# Altium project Safety_Lock.PrjPcb
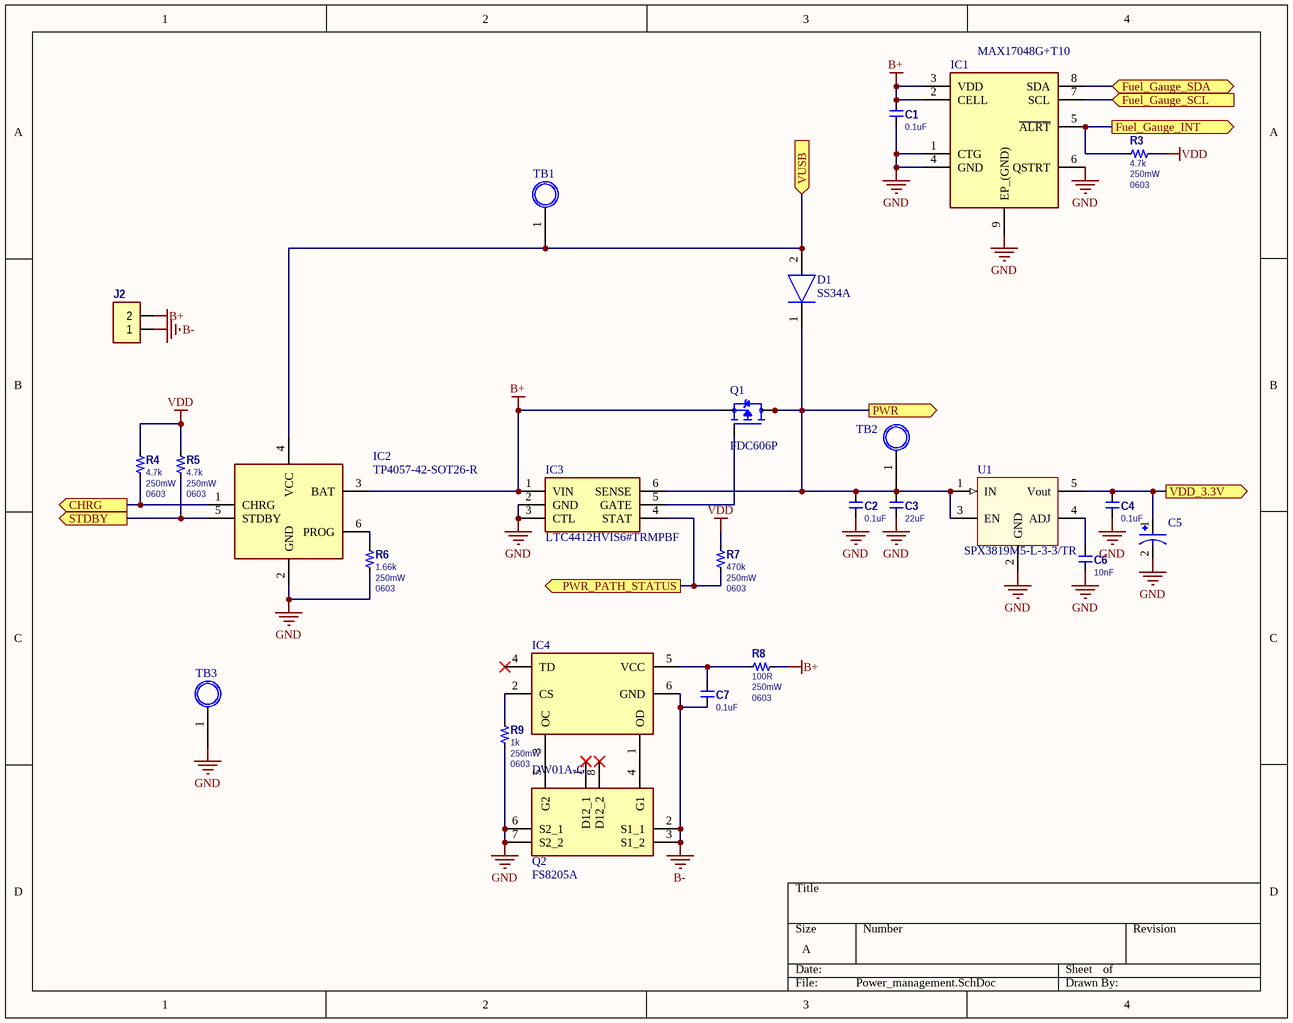
[diagram p0: Power_management.SchDoc]
3 sheets, 66 parts. Net scope: flat (ports and power ports of the same name join across sheets).
Board file: Safety_Lock.PcbDoc
Sheets:
  Power_management.SchDoc
  MCU.SchDoc
  Connectors.SchDoc

## Sheet Power_management.SchDoc
size A

### Parts
C1  0.1uF  [0603-C]
C2  0.1uF  [0603-C]
C3  22uF  [0603-C]
C4  0.1uF  [0603-C]
C5  T493X227K010BH6420_220uF  [CAPPM7343X430N]  (value not drawn)
C6  10nF  [0603-C]
C7  0.1uF  [0603-C]
D1  SS34A  [DIOM5026X262N]
IC1  MAX17048G+T10  [SON50P200X200X80-9N-D]
IC2  TP4057-42-SOT26-R  [SOT95P280X125-6N]
IC3  LTC4412HVIS6#TRMPBF  [SOT95P280X100-6N]
IC4  DW01A-G  [SOT95P280X135-6N]
J2  455-2247-ND  [CON_HDR1x2]  (value not drawn)
Q1  FDC606P  [SUPERSOT-6]
Q2  FS8205A  [SOP65P640X120-8N]
R3  4.7k  Power Rating: 250mW  Case/Package: 0603  [0603-R]
R4  4.7k  Power Rating: 250mW  Case/Package: 0603  [0603-R]
R5  4.7k  Power Rating: 250mW  Case/Package: 0603  [0603-R]
R6  1.66k  Power Rating: 250mW  Case/Package: 0603  [0603-R]
R7  470k  Power Rating: 250mW  Case/Package: 0603  [0603-R]
R8  100R  Power Rating: 250mW  Case/Package: 0603  [0603-R]
R9  1k  Power Rating: 250mW  Case/Package: 0603  [0603-R]
TB1  Test_Pad  [Test_Pad]  (value not drawn)
TB2  Test_Pad  [Test_Pad]  (value not drawn)
TB3  Test_Pad  [Test_Pad]  (value not drawn)
U1  SPX3819M5-L-3-3/TR  [SOT23-5]

### Ports
CHRG (out), Fuel_Gauge_INT (out), Fuel_Gauge_SCL (in), Fuel_Gauge_SDA (bidir), PWR (out), PWR_PATH_STATUS (out), STDBY (out), VDD_3.3V (out), VUSB (in)

### Nets
B+: C1.1 IC1.2(CELL) IC1.3(VDD) IC2.3(BAT) IC3.1(VIN) J2.2 Q1.4(S) R8.2
B-: C7.2 IC4.6(GND) J2.1 Q2.2(S1_1) Q2.3(S1_2)
GND: C1.2 C2.2 C3.2 C4.2 C5.2 C6.2 IC1.1(CTG) IC1.4(GND) IC1.6(QSTRT) IC1.9(EP_(GND)) IC2.2(GND) IC3.2(GND) IC3.3(CTL) Q2.6(S2_1) Q2.7(S2_2) R6.2 R9.2 TB3.1 U1.2(GND)
VDD: R3.2 R4.1 R5.1 R7.2
NetC2_1: C2.1 C3.1 D1.1(K) IC3.6(SENSE) Q1.1(D) Q1.2(D) Q1.5(D) Q1.6(D) TB2.1 U1.1(IN) U1.3(EN) ; port PWR
NetC4_1: C4.1 C5.1 U1.5(Vout) ; port VDD_3.3V
NetC6_1: C6.1 U1.4(ADJ)
NetC7_1: C7.1 IC4.5(VCC) R8.1
NetD1_2: D1.2(A) IC2.4(VCC) TB1.1 ; port VUSB
NetIC1_5: IC1.5(~{ALRT}) R3.1 ; port Fuel_Gauge_INT
NetIC1_7: IC1.7(SCL) ; port Fuel_Gauge_SCL
NetIC1_8: IC1.8(SDA) ; port Fuel_Gauge_SDA
NetIC2_1: IC2.1(CHRG) R4.2 ; port CHRG
NetIC2_5: IC2.5(STDBY) R5.2 ; port STDBY
NetIC2_6: IC2.6(PROG) R6.1
NetIC3_4: IC3.4(STAT) R7.1 ; port PWR_PATH_STATUS
NetIC3_5: IC3.5(GATE) Q1.3(G)
NetIC4_1: IC4.1(OD) Q2.4(G1)
NetIC4_2: IC4.2(CS) R9.1
NetIC4_3: IC4.3(OC) Q2.5(G2)

Not connected (* = marked no-connect by the designer): IC4 4(TD)*; Q2 1(D12_1)* 8(D12_2)*

### Library data of the parts
C1-C4 C6 C7 = CAP: Manufacturer: TDK EPCOS; Manufacturer Part Number: B37941K9105K62; Capacitance: 1uF; Voltage Rating: 16V; Tolerance: 10%; ComponentLink1URL: https://datasheet.ciiva.com/13389/upy-gphc-y5v-6-3v-to-50v-5-13389978.pdf?src-supplier=Mouser; ComponentLink1Description: Datasheet; Supplier 1: Digi-Key; RoHS: Yes; Category: Ceramic Capacitors; Mount: Surface Mount; Case/Package: 0805; Case Code (Metric): 2012; Case Code (Imperial): 0805; Min Operating Temperature: -55°C; Max Operating Temperature: 125°C; Package Quantity: 3000; Packaging: Tape and Reel; Voltage Rating (DC): 16V; Length: 0.079inch; Width: 0.049inch; Height: 1.35mm; Thickness: 0.049inch; Ratings: AEC-Q200; Lead Free: Lead Free; ComponentLink2URL: http://components.arrow.com/part/dataview/0323_01879911?src-supplier=Arrow+Europe; ComponentLink2Description: http://components.arrow.com/part/dataview/0323_01879911?src-supplier=Arrow+Europe; ComponentLink3URL: https://media.digikey.com/pdf/Data%20Sheets/Epcos%20PDFs/B37872K_B37941K_Series.pdf?src-supplier=Digi-Key; ComponentLink3Description: https://media.digikey.com/pdf/Data%20Sheets/Epcos%20PDFs/B37872K_B37941K_Series.pdf?src-supplier=Digi-Key; Supplier Part Number 1: 495-1935-1-ND
C5 = T493X227K010BH6420_220uF: MF: Kemet; Value: *; MP: T493X227K010BH6420; Package: SMD-2 Kemet; Availability: In Stock; Check_prices: https://www.snapeda.com/parts/T493X227K010BH6420/Kemet/view-part/?ref=eda; SnapEDA_Link: https://www.snapeda.com/parts/T493X227K010BH6420/Kemet/view-part/?ref=snap; Price: None
D1 = SS34A: Diode; Manufacturer_Name: HY Electronic Corp; Datasheet Link: https://datasheet.datasheetarchive.com/originals/distributors/Datasheets-3/DSA-43252.pdf; Height: 2.62mm; Manufacturer_Part_Number: SS34A
IC1 = MAX17048G+T10: Integrated Circuit; Manufacturer_Name: Maxim Integrated; Datasheet Link: https://datasheets.maximintegrated.com/en/ds/MAX17048-MAX17049.pdf; Height: 0.8mm; Manufacturer_Part_Number: MAX17048G+T10; Mouser Part Number: 700-MAX17048G+T10; Mouser Price/Stock: https://www.mouser.co.uk/ProductDetail/Maxim-Integrated/MAX17048G%2bT10?qs=D7PJwyCwLAoGnnn8jEPRBQ%3D%3D; Arrow Part Number: MAX17048G+T10; Arrow Price/Stock: https://www.arrow.com/en/products/max17048gt10/maxim-integrated?region=nac
IC2 = TP4057-42-SOT26-R: Integrated Circuit; Manufacturer_Name: Nanjing Extension Microelectronics; Datasheet Link: https://datasheet.lcsc.com/szlcsc/Nanjing-Extension-Microelectronics-TP4057_C12044.pdf; Height: 1.25mm; Manufacturer_Part_Number: TP4057-42-SOT26-R
IC3 = LTC4412HVIS6#TRMPBF: Integrated Circuit; Manufacturer_Name: Linear Technology; Datasheet Link: https://datasheet.datasheetarchive.com/originals/dk/DKDS-14/267243.pdf; Height: 1mm; Manufacturer_Part_Number: LTC4412HVIS6#TRMPBF; Mouser Part Number: 584-C4412HVIS6TRMPBF; Mouser Price/Stock: https://www.mouser.co.uk/ProductDetail/Analog-Devices-Linear-Technology/LTC4412HVIS6TRMPBF?qs=hVkxg5c3xu%2F0qD9zc%2Fd4vw%3D%3D; Arrow Part Number: LTC4412HVIS6#TRMPBF; Arrow Price/Stock: https://www.arrow.com/en/products/ltc4412hvis6trmpbf/linear-technology
IC4 = DW01A-G: Integrated Circuit; Manufacturer_Name: Fortune Semiconductor Corporation; Datasheet Link: http://acoptex.com/uploads/DW01A.pdf; Height: 1.35mm; Manufacturer_Part_Number: DW01A-G
J2 = CON_HDR1x2: ComponentLink1URL: https://www.jst-mfg.com/product/pdf/eng/eXH.pdf; ComponentLink1Description: Datasheet
Q1 = FDC606P: P-Channel 12V 6A (Ta) 1.6W (Ta) Surface Mount SuperSOTâ„¢-6; MF: ON Semiconductor; Price: None; Purchase-URL: https://pricing.snapeda.com/search/part/FDC606P/?ref=eda; Value: *; Availability: Good; Check_prices: https://www.snapeda.com/parts/FDC606P/ON%20Semiconductor/view-part/2501971/?ref=eda; SnapEDA_Link: https://www.snapeda.com/parts/FDC606P/ON%20Semiconductor/view-part/2501971/?ref=snap; MP: FDC606P; Package: TSOT-23-6 ON Semiconductor
Q2 = FS8205A: Transistor; Manufacturer_Name: SII Semiconductor; Datasheet Link: http://www.ic-fortune.com/upload/Download/FS8205A-DS-12_EN.pdf; Height: 1.2mm; Manufacturer_Part_Number: FS8205A
R3-R9 = Res: Manufacturer: Panasonic; Manufacturer Part Number: ERJ-8GEYJ621V; Resistance: 620R; Tolerance: 5%; Voltage Rating: 200V; Temperature Coefficient: 200ppm/°C; ComponentLink1URL: https://datasheet.ciiva.com/15193/getdatasheetpartid-366470-15193725.pdf?src-supplier=Verical; ComponentLink1Description: Datasheet; Supplier 1: Avnet; Stock 1: 6255; Pricing 1: 1 = 0.01200 (USD); RoHS: Yes; Mount: Surface Mount; Case Code (Metric): 3216; Case Code (Imperial): 1206; Contact Plating: Tin; Min Operating Temperature: -55°C; Max Operating Temperature: 155°C; Packaging: Tape and Reel; Package Quantity: 1; Resistor Type: Thick Film; Number of Terminations: 2; Max Power Dissipation: 250mW; Voltage Rating (DC): 200V; Features: Automotive AEC-Q200; Series: ERJ; Construction: Rectangular; Resistance Tolerance: 5%; Length: 3.2mm; Width: 0.063inch; Height: 0.028inch; Depth: 1.6mm; Radiation Hardening: No; REACH SVHC: No SVHC; Military Standard: Not; Lead Free: Lead Free; RoHS Compliant: Yes; ComponentLink2URL: https://datasheet.ciiva.com/46387/1500035-46387094.pdf?src-supplier=Element14; ComponentLink2Description: https://datasheet.ciiva.com/46387/1500035-46387094.pdf?src-supplier=Element14; ComponentLink3URL: https://datasheet.ciiva.com/5915/1500035-5915369.pdf?src-supplier=Farnell; ComponentLink3Description: https://datasheet.ciiva.com/5915/1500035-5915369.pdf?src-supplier=Farnell; ComponentLink4URL: https://datasheet.ciiva.com/28677/1678796-28677018.pdf?src-supplier=Element14; ComponentLink4Description: https://datasheet.ciiva.com/28677/1678796-28677018.pdf?src-supplier=Element14; ComponentLink5URL: https://datasheet.ciiva.com/17204/aoa0000ce1-17204972.pdf?src-supplier=Avnet+Europe; ComponentLink5Description: https://datasheet.ciiva.com/17204/aoa0000ce1-17204972.pdf?src-supplier=Avnet+Europe; ComponentLink6URL: https://datasheet.ciiva.com/16515/aoa0000ce1-16515933.pdf?src-supplier=Avnet+Asia; ComponentLink6Description: https://datasheet.ciiva.com/16515/aoa0000ce1-16515933.pdf?src-supplier=Avnet+Asia; Supplier Part Number 1: 65T8955
U1 = SPX3819: Linear Voltage Regulator IC 1 Output 500mA SOT-23-5; MF: MaxLinear, Inc.; SnapEDA_Link: https://www.snapeda.com/parts/SPX3819/MaxLinear,%20Inc./view-part/885098/?ref=snap; Package: SOT-23-5 MaxLinear, Inc.; Availability: Unavailable; Price: None; MP: SPX3819; Value: *

## Sheet MCU.SchDoc: MCU
size A4; DocumentNumber: MB1136; Revision: C.3; SheetNumber: 2; SheetTotal: 4; Project: NUCLEO-XXXXRX
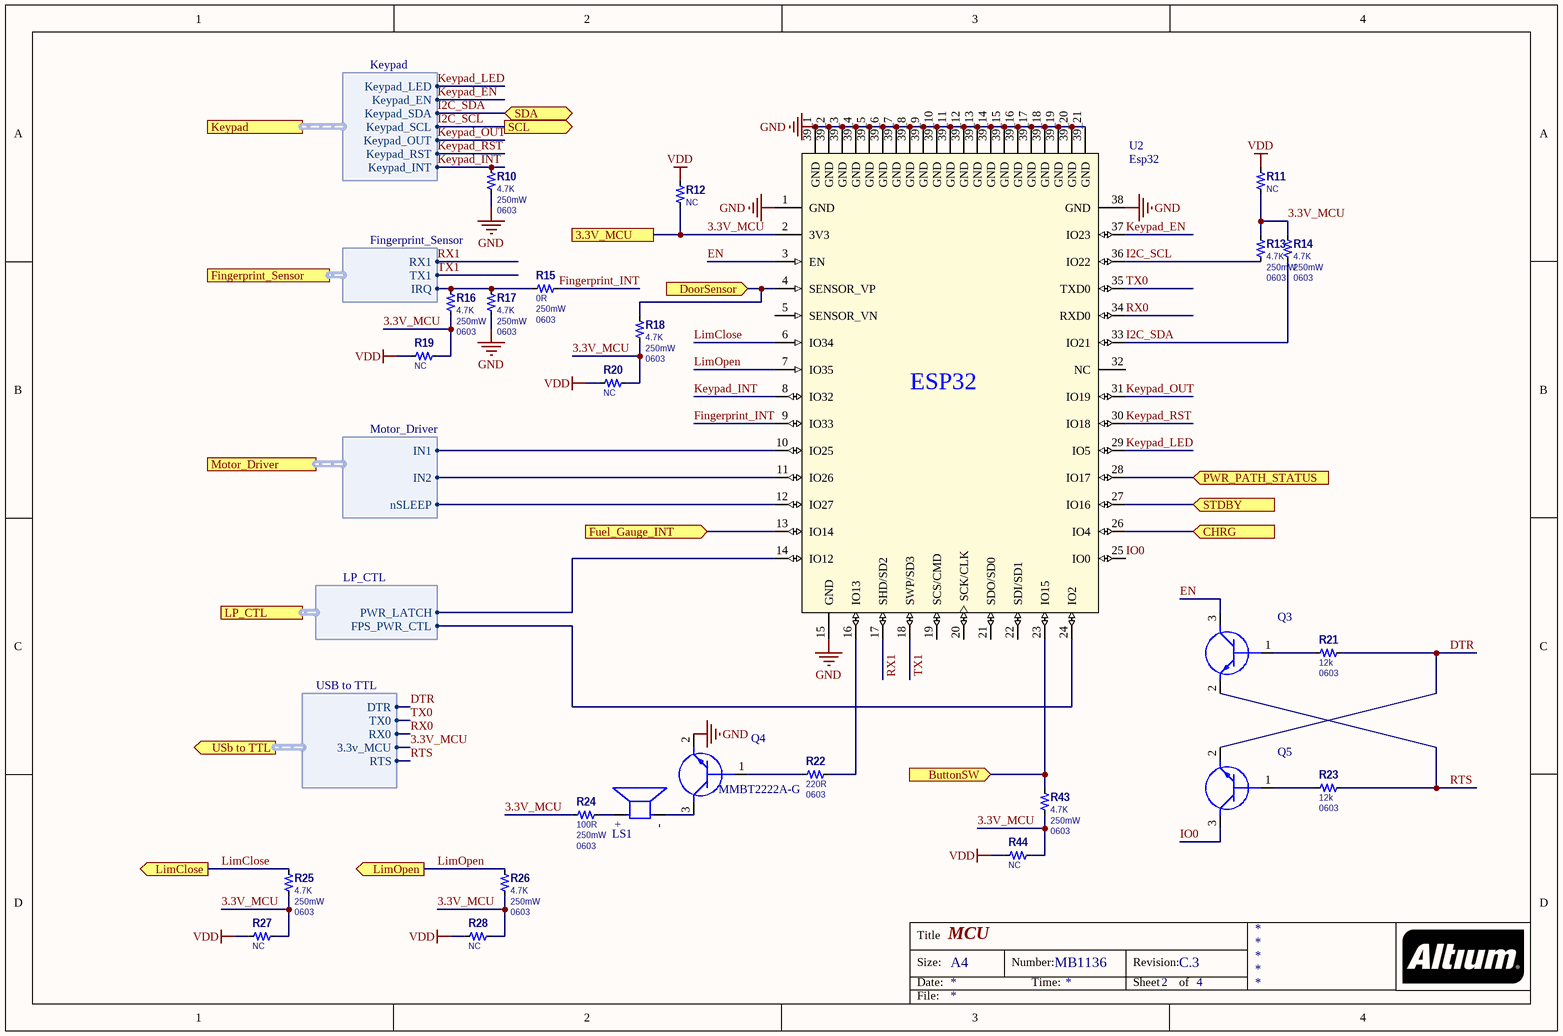
[diagram p1: MCU.SchDoc]

### Parts
LS1  AI-1223-TWT-3V-2-R  [XDCR_AI-1223-TWT-3V-2-R]  (value not drawn)
Q3  MMBT2222A-G  [SOT95P240X115-3N]  (value not drawn)
Q4  MMBT2222A-G  [SOT95P240X115-3N]
Q5  MMBT2222A-G  [SOT95P240X115-3N]  (value not drawn)
R10  4.7K  Power Rating: 250mW  Case/Package: 0603  [0603-R]
R11  NC  [0603-R]
R12  NC  [0603-R]
R13  4.7K  Power Rating: 250mW  Case/Package: 0603  [0603-R]
R14  4.7K  Power Rating: 250mW  Case/Package: 0603  [0603-R]
R15  0R  Power Rating: 250mW  Case/Package: 0603  [0603-R]
R16  4.7K  Power Rating: 250mW  Case/Package: 0603  [0603-R]
R17  4.7K  Power Rating: 250mW  Case/Package: 0603  [0603-R]
R18  4.7K  Power Rating: 250mW  Case/Package: 0603  [0603-R]
R19  NC  [0603-R]
R20  NC  [0603-R]
R21  12k  Case/Package: 0603  [0603-R]
R22  220R  Case/Package: 0603  [0603-R]
R23  12k  Case/Package: 0603  [0603-R]
R24  100R  Power Rating: 250mW  Case/Package: 0603  [0603-R]
R25  4.7K  Power Rating: 250mW  Case/Package: 0603  [0603-R]
R26  4.7K  Power Rating: 250mW  Case/Package: 0603  [0603-R]
R27  NC  [0603-R]
R28  NC  [0603-R]
R43  4.7K  Power Rating: 250mW  Case/Package: 0603  [0603-R]
R44  NC  [0603-R]
U2  Esp32  [MODULE_ESP32-WROOM-32]

### Ports
3.3V_MCU, ButtonSW (in), CHRG (in), DoorSensor (in), Fingerprint_Sensor (harness Fingerprint_Sensor), Fuel_Gauge_INT (in), Keypad (harness Keypad), LimClose (out), LimOpen (out), LP_CTL (harness LP_CTL), Motor_Driver (harness Motor_Driver), PWR_PATH_STATUS (in), SCL (out), SDA (bidir), STDBY (in), USb to TTL (out, harness USB to TTL)

### Harnesses
Keypad: Keypad_RST, Keypad_EN, Keypad_SDA, Keypad_SCL, Keypad_OUT, Keypad_INT, Keypad_LED
Fingerprint_Sensor: RX1, TX1, IRQ
Motor_Driver: IN1, IN2, nSLEEP
LP_CTL: PWR_LATCH, FPS_PWR_CTL
USB to TTL: TX0, RX0, DTR, RTS, 3.3v_MCU

### Nets
GND: Q4.2(E) R10.2 R17.2 U2.1(GND) U2.15(GND) U2.38(GND) U2.39_1(GND) U2.39_2(GND) U2.39_3(GND) U2.39_4(GND) U2.39_5(GND) U2.39_6(GND) U2.39_7(GND) U2.39_8(GND) U2.39_9(GND) U2.39_10(GND) U2.39_11(GND) U2.39_12(GND) U2.39_13(GND) U2.39_14(GND) U2.39_15(GND) U2.39_16(GND) U2.39_17(GND) U2.39_18(GND) U2.39_19(GND) U2.39_20(GND) U2.39_21(GND)
VDD: R11.2 R12.2 R19.1 R20.1 R27.1 R28.1 R44.1
3.3V_MCU: R11.1 R12.1 R13.1 R14.1 R16.2 R18.2 R19.2 R20.2 R24.1 R25.2 R26.2 R27.2 R28.2 R43.2 R44.2 U2.2(3V3) ; port 3.3V_MCU, port USb to TTL.3.3v_MCU
DTR: Q5.2(E) R21.1 ; port USb to TTL.DTR
EN: Q3.3(C) U2.3(EN)
Fingerprint_INT: R15.2 U2.9(IO33)
I2C_SCL: R13.2 U2.36(IO22) ; port SCL, port Keypad.Keypad_SCL
I2C_SDA: R14.2 U2.33(IO21) ; port SDA, port Keypad.Keypad_SDA
IO0: Q5.3(C) U2.25(IO0)
Keypad_EN: U2.37(IO23) ; port Keypad.Keypad_EN
Keypad_INT: R10.1 U2.8(IO32) ; port Keypad.Keypad_INT
Keypad_LED: U2.29(IO5) ; port Keypad.Keypad_LED
Keypad_OUT: U2.31(IO19) ; port Keypad.Keypad_OUT
Keypad_RST: U2.30(IO18) ; port Keypad.Keypad_RST
LimClose: R25.1 U2.6(IO34) ; port LimClose
LimOpen: R26.1 U2.7(IO35) ; port LimOpen
RTS: Q3.2(E) R23.1 ; port USb to TTL.RTS
RX0: U2.34(RXD0) ; port USb to TTL.RX0
RX1: U2.17(SHD/SD2) ; port Fingerprint_Sensor.RX1
TX0: U2.35(TXD0) ; port USb to TTL.TX0
TX1: U2.18(SWP/SD3) ; port Fingerprint_Sensor.TX1
NetIC1_5: U2.13(IO14) ; port Fuel_Gauge_INT
NetIC2_1: U2.26(IO4) ; port CHRG
NetIC2_5: U2.27(IO16) ; port STDBY
NetIC3_4: U2.28(IO17) ; port PWR_PATH_STATUS
NetJ5_5: R15.1 R16.1 R17.1 ; port Fingerprint_Sensor.IRQ
NetJ10_1: R18.1 U2.4(SENSOR_VP) ; port DoorSensor
NetJ11_1: R43.1 U2.23(IO15) ; port ButtonSW
NetLS1_N: LS1.N Q4.3(C)
NetLS1_P: LS1.P R24.2
NetQ3_1: Q3.1(B) R21.2
NetQ4_1: Q4.1(B) R22.2
NetQ5_1: Q5.1(B) R23.2
NetR22_1: R22.1 U2.16(IO13)
NetU2_10: U2.10(IO25) ; port Motor_Driver.IN1
NetU2_11: U2.11(IO26) ; port Motor_Driver.IN2
NetU2_12: U2.12(IO27) ; port Motor_Driver.nSLEEP
NetU2_14: U2.14(IO12) ; port LP_CTL.PWR_LATCH
NetU2_24: U2.24(IO2) ; port LP_CTL.FPS_PWR_CTL

Not connected (* = marked no-connect by the designer): U2 5(SENSOR_VN) 19(SCS/CMD) 20(SCK/CLK) 21(SDO/SD0) 22(SDI/SD1) 32(NC)

### Notes on the sheet
- Title
- Size:
- Date:
- A4
- Number:
- Time:
- Revision:
- Sheet
- of
- File:
- (in symbol AI-1223-TWT-3V-2-R) +; -
- (in symbol ESP32-WROOM-32) ESP32

### Library data of the parts
LS1 = AI-1223-TWT-3V-2-R: AUDIO INDICATOR 82 DB 3 VDC 2300 HZ; MF: PUI Audio,; SnapEDA_Link: https://www.snapeda.com/parts/AI-1223-TWT-3V-2-R/PUI%20Audio,%20Inc./view-part/548758/?ref=snap; Availability: In Stock; Price: None; Purchase-URL: https://pricing.snapeda.com/search/part/AI-1223-TWT-3V-2-R/?ref=eda; Check_prices: https://www.snapeda.com/parts/AI-1223-TWT-3V-2-R/PUI%20Audio,%20Inc./view-part/548758/?ref=eda; Package: None; MP: AI-1223-TWT-3V-2-R; Value: *
Q3 = MMBT2222A-G_Mirror: Transistor BJT NPN; Manufacturer_Name: Comchip Technology; Datasheet Link: http://www.comchiptech.com/admin/files/product/MMBT2222A-G%20RevB.pdf; Height: 1.15mm; Manufacturer_Part_Number: MMBT2222A-G; Mouser Part Number: 750-MMBT2222A-G; Mouser Price/Stock: https://www.mouser.co.uk/ProductDetail/Comchip-Technology/MMBT2222A-G?qs=2qJf6qQ4IOIM%2FSE9iCL8gQ%3D%3D; Arrow Part Number: MMBT2222A-G; Arrow Price/Stock: https://www.arrow.com/en/products/mmbt2222a-g/comchip-technology
Q4 Q5 = MMBT2222A-G: Transistor BJT NPN; Manufacturer_Name: Comchip Technology; Datasheet Link: http://www.comchiptech.com/admin/files/product/MMBT2222A-G%20RevB.pdf; Height: 1.15mm; Manufacturer_Part_Number: MMBT2222A-G; Mouser Part Number: 750-MMBT2222A-G; Mouser Price/Stock: https://www.mouser.co.uk/ProductDetail/Comchip-Technology/MMBT2222A-G?qs=2qJf6qQ4IOIM%2FSE9iCL8gQ%3D%3D; Arrow Part Number: MMBT2222A-G; Arrow Price/Stock: https://www.arrow.com/en/products/mmbt2222a-g/comchip-technology
R10 R13-R18 R24-R26 R43 = Res: as R3 on sheet Power_management; ComponentLink1URL: https://datasheet.ciiva.com/15193/getdatasheetpartid-366470-15193725.pdf?src-supplier=Verical; ComponentLink1Description: Datasheet; Supplier 1: Avnet; Stock 1: 6255; Pricing 1: 1 = 0.01200 (USD); RoHS: Yes; Mount: Surface Mount; Case Code (Metric): 3216; Case Code (Imperial): 1206; Contact Plating: Tin; Min Operating Temperature: -55°C; Max Operating Temperature: 155°C; Packaging: Tape and Reel; Package Quantity: 1; Resistor Type: Thick Film; Number of Terminations: 2; Max Power Dissipation: 250mW; Voltage Rating (DC): 200V; Features: Automotive AEC-Q200; Series: ERJ; Construction: Rectangular; Resistance Tolerance: 5%; Length: 3.2mm; Width: 0.063inch; Height: 0.028inch; Depth: 1.6mm; Radiation Hardening: No; REACH SVHC: No SVHC; Military Standard: Not; Lead Free: Lead Free; RoHS Compliant: Yes; ComponentLink2URL: https://datasheet.ciiva.com/46387/1500035-46387094.pdf?src-supplier=Element14; ComponentLink2Description: https://datasheet.ciiva.com/46387/1500035-46387094.pdf?src-supplier=Element14; ComponentLink3URL: https://datasheet.ciiva.com/5915/1500035-5915369.pdf?src-supplier=Farnell; ComponentLink3Description: https://datasheet.ciiva.com/5915/1500035-5915369.pdf?src-supplier=Farnell; ComponentLink4URL: https://datasheet.ciiva.com/28677/1678796-28677018.pdf?src-supplier=Element14; ComponentLink4Description: https://datasheet.ciiva.com/28677/1678796-28677018.pdf?src-supplier=Element14; ComponentLink5URL: https://datasheet.ciiva.com/17204/aoa0000ce1-17204972.pdf?src-supplier=Avnet+Europe; ComponentLink5Description: https://datasheet.ciiva.com/17204/aoa0000ce1-17204972.pdf?src-supplier=Avnet+Europe; ComponentLink6URL: https://datasheet.ciiva.com/16515/aoa0000ce1-16515933.pdf?src-supplier=Avnet+Asia; ComponentLink6Description: https://datasheet.ciiva.com/16515/aoa0000ce1-16515933.pdf?src-supplier=Avnet+Asia; Supplier Part Number 1: 65T8955
R11 R12 R19-R23 R27 R28 R44 = Res: Manufacturer: Panasonic; Manufacturer Part Number: ERJ-8GEYJ621V; Resistance: 620R; Tolerance: 5%; Voltage Rating: 200V; Temperature Coefficient: 200ppm/°C; Max Power Dissipation: 250mW; ComponentLink1URL: https://datasheet.ciiva.com/15193/getdatasheetpartid-366470-15193725.pdf?src-supplier=Verical; ComponentLink1Description: Datasheet; Supplier 1: Avnet; Stock 1: 6255; Pricing 1: 1 = 0.01200 (USD); RoHS: Yes; Mount: Surface Mount; Case Code (Metric): 3216; Case Code (Imperial): 1206; Contact Plating: Tin; Min Operating Temperature: -55°C; Max Operating Temperature: 155°C; Packaging: Tape and Reel; Package Quantity: 1; Resistor Type: Thick Film; Number of Terminations: 2; Voltage Rating (DC): 200V; Features: Automotive AEC-Q200; Series: ERJ; Construction: Rectangular; Resistance Tolerance: 5%; Length: 3.2mm; Width: 0.063inch; Height: 0.028inch; Depth: 1.6mm; Radiation Hardening: No; REACH SVHC: No SVHC; Military Standard: Not; Lead Free: Lead Free; RoHS Compliant: Yes; ComponentLink2URL: https://datasheet.ciiva.com/46387/1500035-46387094.pdf?src-supplier=Element14; ComponentLink2Description: https://datasheet.ciiva.com/46387/1500035-46387094.pdf?src-supplier=Element14; ComponentLink3URL: https://datasheet.ciiva.com/5915/1500035-5915369.pdf?src-supplier=Farnell; ComponentLink3Description: https://datasheet.ciiva.com/5915/1500035-5915369.pdf?src-supplier=Farnell; ComponentLink4URL: https://datasheet.ciiva.com/28677/1678796-28677018.pdf?src-supplier=Element14; ComponentLink4Description: https://datasheet.ciiva.com/28677/1678796-28677018.pdf?src-supplier=Element14; ComponentLink5URL: https://datasheet.ciiva.com/17204/aoa0000ce1-17204972.pdf?src-supplier=Avnet+Europe; ComponentLink5Description: https://datasheet.ciiva.com/17204/aoa0000ce1-17204972.pdf?src-supplier=Avnet+Europe; ComponentLink6URL: https://datasheet.ciiva.com/16515/aoa0000ce1-16515933.pdf?src-supplier=Avnet+Asia; ComponentLink6Description: https://datasheet.ciiva.com/16515/aoa0000ce1-16515933.pdf?src-supplier=Avnet+Asia; Supplier Part Number 1: 65T8955; Power Rating: 250mW
  R11 R12 R19 R20 R27 R28 R44: Case/Package: 0603
U2 = ESP32-WROOM-32: Bluetooth, WiFi Transceiver Module 2.4GHz ~ 2.5GHz Surface Mount; MF: Espressif Systems; Package: Module Espressif Systems; Digi-Key_Part_Number: 1904-1010-1-ND; Digi-Key_Purchase_URL: https://www.digikey.com/product-detail/en/espressif-systems/ESP32-WROOM-32/1904-1010-1-ND/8544305?utm_source=snapeda&utm_medium=aggregator&utm_campaign=symbol; Value: *; MP: ESP32-WROOM-32; SnapEDA_Link: https://www.snapeda.com/parts/ESP32-WROOM-32/Espressif%20Systems/view-part/2753322/?ref=snap

## Sheet Connectors.SchDoc
size A3
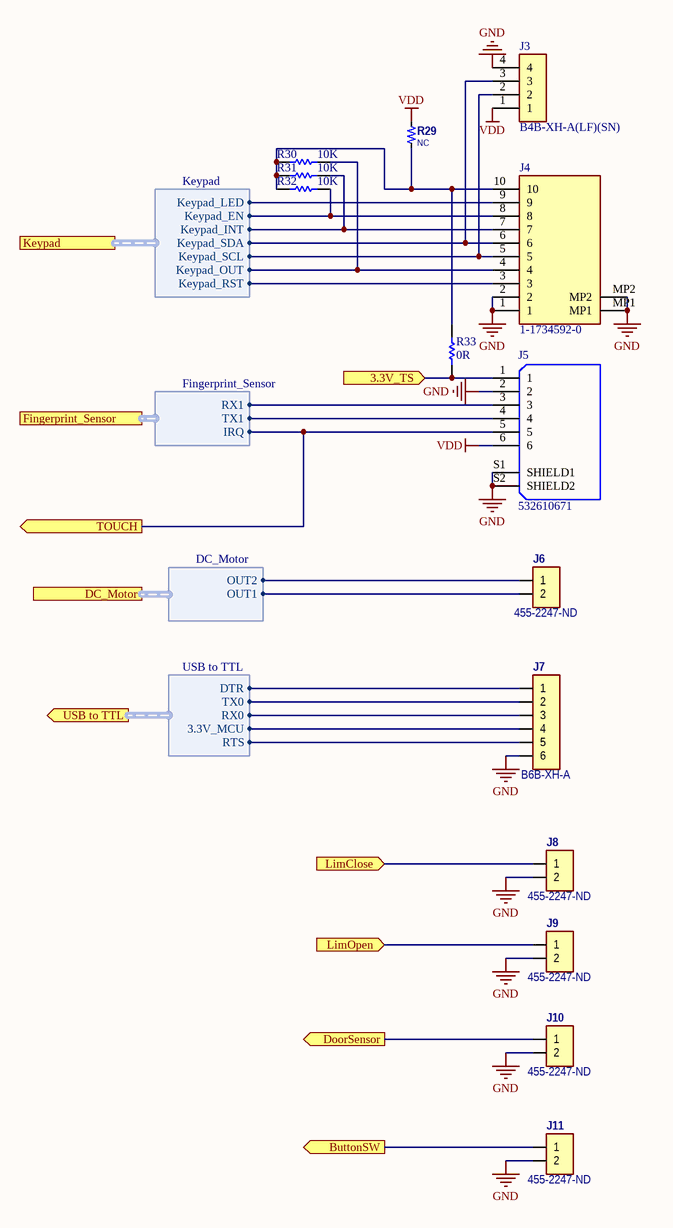
[diagram p2: Connectors.SchDoc]

### Parts
J3  B4B-XH-A(LF)(SN)  [JST_B4B-XH-A(LF)(SN)]
J4  1-1734592-0  [117345920]
J5  532610671  [MOLEX_532610671]
J6  455-2247-ND  [CON_HDR1x2]
J7  B6B-XH-A  [CON_HDR1x6_2p50_SHRD_JST-B6B-XH-A]
J8  455-2247-ND  [CON_HDR1x2]
J9  455-2247-ND  [CON_HDR1x2]
J10  455-2247-ND  [CON_HDR1x2]
J11  455-2247-ND  [CON_HDR1x2]
R29  NC  [0603-R]
R30  10K  [0603R]
R31  10K  [0603R]
R32  10K  [0603R]
R33  0R  [0603R]

### Ports
3.3V_TS (in), ButtonSW (out), DC_Motor (harness DC_Motor), DoorSensor (out), Fingerprint_Sensor (harness Fingerprint_Sensor), Keypad (harness Keypad), LimClose (in), LimOpen (in), TOUCH (out), USB to TTL (out, harness USB to TTL)

### Harnesses
Keypad: Keypad_RST, Keypad_EN, Keypad_SDA, Keypad_SCL, Keypad_OUT, Keypad_INT, Keypad_LED
Fingerprint_Sensor: RX1, TX1, IRQ
DC_Motor: OUT1, OUT2
USB to TTL: TX0, RX0, DTR, RTS, 3.3V_MCU

### Nets
GND: J3.4 J4.1 J4.2 J4.MP1 J4.MP2 J5.2 J5.S1(SHIELD1) J5.S2(SHIELD2) J7.6 J8.2 J9.2 J10.2 J11.2
VDD: J3.1 J5.6 R29.2
3.3V_MCU: J7.4 ; port USB to TTL.3.3V_MCU
DTR: J7.1 ; port USB to TTL.DTR
I2C_SCL: J3.2 J4.5 ; port Keypad.Keypad_SCL
I2C_SDA: J3.3 J4.6 ; port Keypad.Keypad_SDA
Keypad_EN: J4.8 R32.2 ; port Keypad.Keypad_EN
Keypad_INT: J4.7 R31.2 ; port Keypad.Keypad_INT
Keypad_LED: J4.9 ; port Keypad.Keypad_LED
Keypad_OUT: J4.4 R30.2 ; port Keypad.Keypad_OUT
Keypad_RST: J4.3 ; port Keypad.Keypad_RST
LimClose: J8.1 ; port LimClose
LimOpen: J9.1 ; port LimOpen
RTS: J7.5 ; port USB to TTL.RTS
RX0: J7.3 ; port USB to TTL.RX0
RX1: J5.3 ; port Fingerprint_Sensor.RX1
TX0: J7.2 ; port USB to TTL.TX0
TX1: J5.4 ; port Fingerprint_Sensor.TX1
NetJ4_10: J4.10 R29.1 R30.1 R31.1 R32.1 R33.2
NetJ5_1: J5.1 R33.1 ; port 3.3V_TS
NetJ5_5: J5.5 ; port TOUCH, port Fingerprint_Sensor.IRQ
NetJ6_1: J6.1 ; port DC_Motor.OUT2
NetJ6_2: J6.2 ; port DC_Motor.OUT1
NetJ10_1: J10.1 ; port DoorSensor
NetJ11_1: J11.1 ; port ButtonSW

### Library data of the parts
J3 = B4B-XH-A(LF)(SN): Connector Header Through Hole 4 position 0.098 (2.50mm); MF: JST Sales; Check_prices: https://www.snapeda.com/parts/B4B-XH-A(LF)(SN)/JST%20Sales%20America%20Inc./view-part/447494/?ref=eda; Purchase-URL: https://pricing.snapeda.com/search/part/B4B-XH-A(LF)(SN)/?ref=eda; SnapEDA_Link: https://www.snapeda.com/parts/B4B-XH-A(LF)(SN)/JST%20Sales%20America%20Inc./view-part/447494/?ref=snap; Price: None; Value: *; MP: B4B-XH-A(LF)(SN); Package: None; Availability: Warning
J4 = 1-1734592-0: Connector; Manufacturer_Name: TE Connectivity; Datasheet Link: https://www.te.com/commerce/DocumentDelivery/DDEController?Action=showdoc&DocId=Customer+Drawing%7F1734592%7FC%7Fpdf%7FEnglish%7FENG_CD_1734592_C_C_1734592.pdf%7F1-1734592-8; Height: 2.3mm; Manufacturer_Part_Number: 1-1734592-0; Mouser Part Number: 571-1-1734592-0; Mouser Price/Stock: https://www.mouser.co.uk/ProductDetail/TE-Connectivity/1-1734592-0?qs=sXy4Dx%2FMQpOH8ogf8%2FvwBg%3D%3D; Arrow Part Number: 1-1734592-0; Arrow Price/Stock: https://www.arrow.com/en/products/1-1734592-0/te-connectivity
J5 = 532610671: Conn Shrouded Header (4 Sides) HDR 6 POS 1.25mm Solder RA Side Entry SMD PicoBladeâ„¢ T/R; MF: Molex; SnapEDA_Link: https://www.snapeda.com/parts/532610671/Molex/view-part/6379096/?ref=snap; Value: *; Purchase-URL: https://pricing.snapeda.com/search/part/532610671/?ref=eda; Check_prices: https://www.snapeda.com/parts/532610671/Molex/view-part/6379096/?ref=eda; MP: 532610671; Digi-Key_Part_Number: WM7624CT-ND; Package: None
J6 J8-J11 = CON_HDR1x2: ComponentLink1URL: https://www.jst-mfg.com/product/pdf/eng/eXH.pdf; ComponentLink1Description: Datasheet
J7 = CON_HDR1x6_2p50_SHRD_JST_B6B-XH-A: CONN HEADER VERT 6POS 2.5MM; Manufacturer: JST; Manufacturer Part Number: B6BXHA(LF)(SN); Contact Resistance: 20mR; Current Rating: 3A; Number of Positions: 6; Voltage Rating (AC): 250V; Insulation Resistance: 1GR; Connector Type: Male Pin; Wire/Cable Gauge: 22AWG; ComponentLink4Description: Datasheet; ComponentLink4URL: http://www.jst-mfg.com/product/pdf/eng/eXH.pdf; Supplier 1: Digi-Key; RoHS: Yes; Category: FFC / FPC; Stock 1: 19126; Pricing 1: 1=0.270000, 10=0.258000, 100=0.180800, 500=0.154940, 1000=0.129120, 5000=0.110680, 10000=0.103300 (USD); Mount: Through Hole; Contact Plating: Tin,Lead,Copper; Contact Material: Brass; Color: Natural; Housing Color: White; Housing Material: Polyamide; Min Operating Temperature: -25°C; Max Operating Temperature: 85°C; Termination: Press-Fit; Package Quantity: 500; Packaging: Bulk; Number of Rows: 1; Voltage Rating: 250V; Number of Contacts: 6; Max Current Rating: 3A; Max Voltage Rating (AC): 250V; Max Voltage Rating (DC): 250V; Orientation: Straight; Length: 17.4mm; Depth: 5.75mm; Pitch: 2.5mm; Lead Pitch: 2.5mm; REACH SVHC: No SVHC; Lead Free: Lead Free; Supplier Part Number 1: 455-2271-ND
R29 = Res: as R11 on sheet MCU; ComponentLink1URL: https://datasheet.ciiva.com/15193/getdatasheetpartid-366470-15193725.pdf?src-supplier=Verical; ComponentLink1Description: Datasheet; Supplier 1: Avnet; Stock 1: 6255; Pricing 1: 1 = 0.01200 (USD); RoHS: Yes; Mount: Surface Mount; Case Code (Metric): 3216; Case Code (Imperial): 1206; Contact Plating: Tin; Min Operating Temperature: -55°C; Max Operating Temperature: 155°C; Packaging: Tape and Reel; Package Quantity: 1; Resistor Type: Thick Film; Number of Terminations: 2; Voltage Rating (DC): 200V; Features: Automotive AEC-Q200; Series: ERJ; Construction: Rectangular; Resistance Tolerance: 5%; Length: 3.2mm; Width: 0.063inch; Height: 0.028inch; Depth: 1.6mm; Radiation Hardening: No; REACH SVHC: No SVHC; Military Standard: Not; Lead Free: Lead Free; RoHS Compliant: Yes; ComponentLink2URL: https://datasheet.ciiva.com/46387/1500035-46387094.pdf?src-supplier=Element14; ComponentLink2Description: https://datasheet.ciiva.com/46387/1500035-46387094.pdf?src-supplier=Element14; ComponentLink3URL: https://datasheet.ciiva.com/5915/1500035-5915369.pdf?src-supplier=Farnell; ComponentLink3Description: https://datasheet.ciiva.com/5915/1500035-5915369.pdf?src-supplier=Farnell; ComponentLink4URL: https://datasheet.ciiva.com/28677/1678796-28677018.pdf?src-supplier=Element14; ComponentLink4Description: https://datasheet.ciiva.com/28677/1678796-28677018.pdf?src-supplier=Element14; ComponentLink5URL: https://datasheet.ciiva.com/17204/aoa0000ce1-17204972.pdf?src-supplier=Avnet+Europe; ComponentLink5Description: https://datasheet.ciiva.com/17204/aoa0000ce1-17204972.pdf?src-supplier=Avnet+Europe; ComponentLink6URL: https://datasheet.ciiva.com/16515/aoa0000ce1-16515933.pdf?src-supplier=Avnet+Asia; ComponentLink6Description: https://datasheet.ciiva.com/16515/aoa0000ce1-16515933.pdf?src-supplier=Avnet+Asia; Supplier Part Number 1: 65T8955; Power Rating: 250mW; Case/Package: 0603
R30-R33 = res1: Resistor; Value: 1K; Published: 8-Jun-2000; Revision: July-2002: Re-released for DXP Platform.; Publisher: Altium Limited

## Nets that join several sheets
GND: Power_management (19 pins), MCU (27 pins), Connectors (13 pins)
VDD: Power_management (R3.2 R4.1 R5.1 R7.2), MCU (7 pins), Connectors (J3.1 J5.6 R29.2)
3.3V_MCU: MCU (16 pins), Connectors (J7.4)
DTR: MCU (Q5.2 R21.1), Connectors (J7.1)
I2C_SCL: MCU (R13.2 U2.36), Connectors (J3.2 J4.5)
I2C_SDA: MCU (R14.2 U2.33), Connectors (J3.3 J4.6)
Keypad_EN: MCU (U2.37), Connectors (J4.8 R32.2)
Keypad_INT: MCU (R10.1 U2.8), Connectors (J4.7 R31.2)
Keypad_LED: MCU (U2.29), Connectors (J4.9)
Keypad_OUT: MCU (U2.31), Connectors (J4.4 R30.2)
Keypad_RST: MCU (U2.30), Connectors (J4.3)
LimClose: MCU (R25.1 U2.6), Connectors (J8.1)
LimOpen: MCU (R26.1 U2.7), Connectors (J9.1)
NetIC1_5: Power_management (IC1.5 R3.1), MCU (U2.13)
NetIC2_1: Power_management (IC2.1 R4.2), MCU (U2.26)
NetIC2_5: Power_management (IC2.5 R5.2), MCU (U2.27)
NetIC3_4: Power_management (IC3.4 R7.1), MCU (U2.28)
NetJ5_5: MCU (R15.1 R16.1 R17.1), Connectors (J5.5)
NetJ10_1: MCU (R18.1 U2.4), Connectors (J10.1)
NetJ11_1: MCU (R43.1 U2.23), Connectors (J11.1)
RTS: MCU (Q3.2 R23.1), Connectors (J7.5)
RX0: MCU (U2.34), Connectors (J7.3)
RX1: MCU (U2.17), Connectors (J5.3)
TX0: MCU (U2.35), Connectors (J7.2)
TX1: MCU (U2.18), Connectors (J5.4)